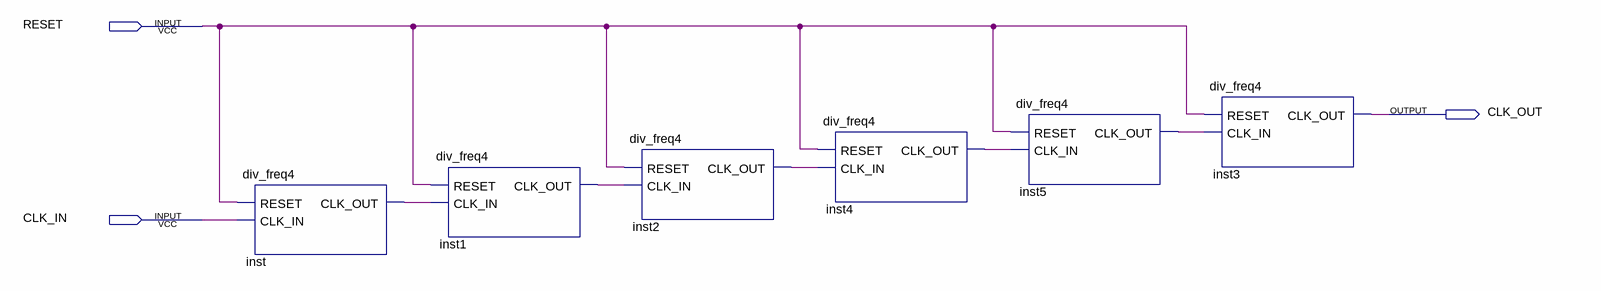
[diagram p0: schematic sheet]
// Quartus schematic div_freq24.bdf as structural Verilog: 6 symbols, 3 pins
module div_freq24 (
  input  RESET,
  input  CLK_IN,
  output CLK_OUT
);

  wire inst1_clk_out, inst2_clk_out, inst4_clk_out, inst5_clk_out, inst_clk_out;

  div_freq4 inst (.RESET(RESET), .CLK_IN(CLK_IN), .CLK_OUT(inst_clk_out));
  div_freq4 inst1 (.RESET(RESET), .CLK_IN(inst_clk_out), .CLK_OUT(inst1_clk_out));
  div_freq4 inst2 (.RESET(RESET), .CLK_IN(inst1_clk_out), .CLK_OUT(inst2_clk_out));
  div_freq4 inst4 (.RESET(RESET), .CLK_IN(inst2_clk_out), .CLK_OUT(inst4_clk_out));
  div_freq4 inst5 (.RESET(RESET), .CLK_IN(inst4_clk_out), .CLK_OUT(inst5_clk_out));
  div_freq4 inst3 (.RESET(RESET), .CLK_IN(inst5_clk_out), .CLK_OUT(CLK_OUT));
endmodule
